# EAGLE design mütes expander (EAGLE 9.3.1)
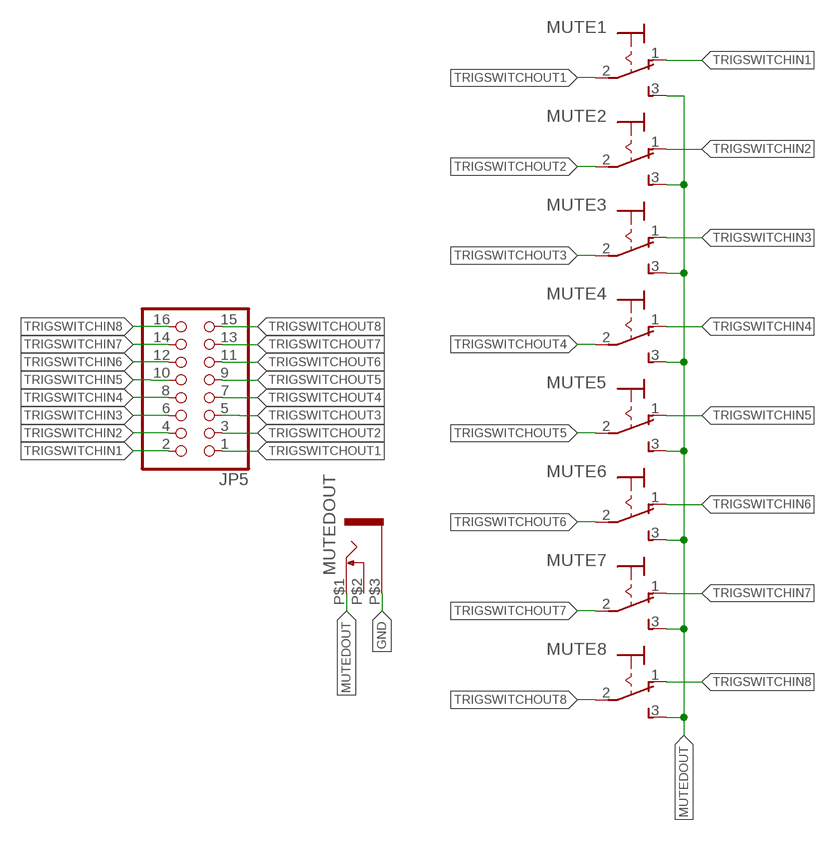
[diagram p0: schematic, sheet 1]

## Parts
JP5  PINHD-2X8  [2X08]
MUTE1  320-916320-916BIG  [320-916MY]
MUTE2  320-916320-916BIG  [320-916MY]
MUTE3  320-916320-916BIG  [320-916MY]
MUTE4  320-916320-916BIG  [320-916MY]
MUTE5  320-916320-916BIG  [320-916MY]
MUTE6  320-916320-916BIG  [320-916MY]
MUTE7  320-916320-916BIG  [320-916MY]
MUTE8  320-916320-916BIG  [320-916MY]
MUTEDOUT  WQP-PJ301M-12_JACK  [WQP-PJ301M-12_JACK]

## Nets
GND: MUTEDOUT.P$3
MUTEDOUT: MUTE1.3(S) MUTE2.3(S) MUTE3.3(S) MUTE4.3(S) MUTE5.3(S) MUTE6.3(S) MUTE7.3(S) MUTE8.3(S) MUTEDOUT.P$1
TRIGSWITCHIN1: JP5.2 MUTE1.1(O)
TRIGSWITCHIN2: JP5.4 MUTE2.1(O)
TRIGSWITCHIN3: JP5.6 MUTE3.1(O)
TRIGSWITCHIN4: JP5.8 MUTE4.1(O)
TRIGSWITCHIN5: JP5.10 MUTE5.1(O)
TRIGSWITCHIN6: JP5.12 MUTE6.1(O)
TRIGSWITCHIN7: JP5.14 MUTE7.1(O)
TRIGSWITCHIN8: JP5.16 MUTE8.1(O)
TRIGSWITCHOUT1: JP5.1 MUTE1.2(P)
TRIGSWITCHOUT2: JP5.3 MUTE2.2(P)
TRIGSWITCHOUT3: JP5.5 MUTE3.2(P)
TRIGSWITCHOUT4: JP5.7 MUTE4.2(P)
TRIGSWITCHOUT5: JP5.9 MUTE5.2(P)
TRIGSWITCHOUT6: JP5.11 MUTE6.2(P)
TRIGSWITCHOUT7: JP5.13 MUTE7.2(P)
TRIGSWITCHOUT8: JP5.15 MUTE8.2(P)
Unconnected: MUTEDOUT.P$2

## Library data of the parts
JP5 = pinhead:PINHD-2X8: PIN HEADER
MUTE1-MUTE8 = switch:320-916: TOGGLE SWITCH distributor RS Components
MUTEDOUT = thonkiconn:WQP-PJ301M-12_JACK

## Board
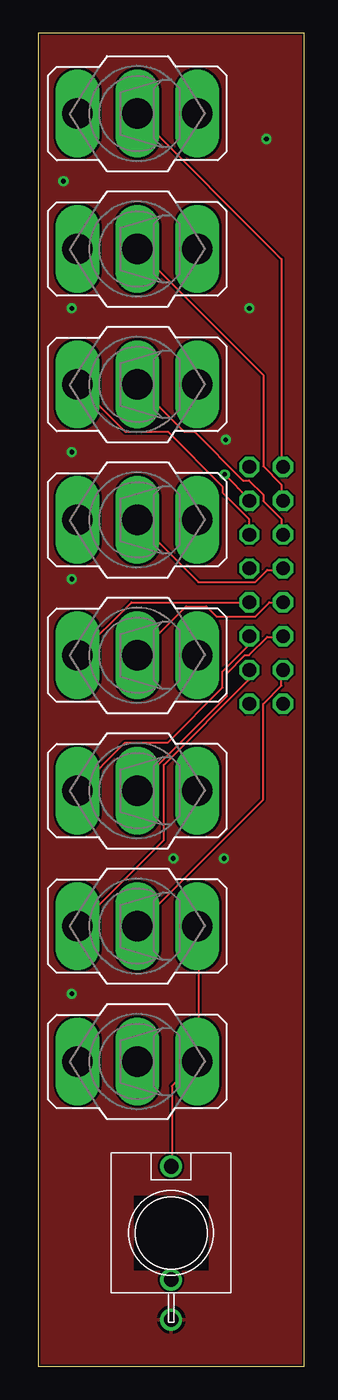
[diagram p1: board, top side]
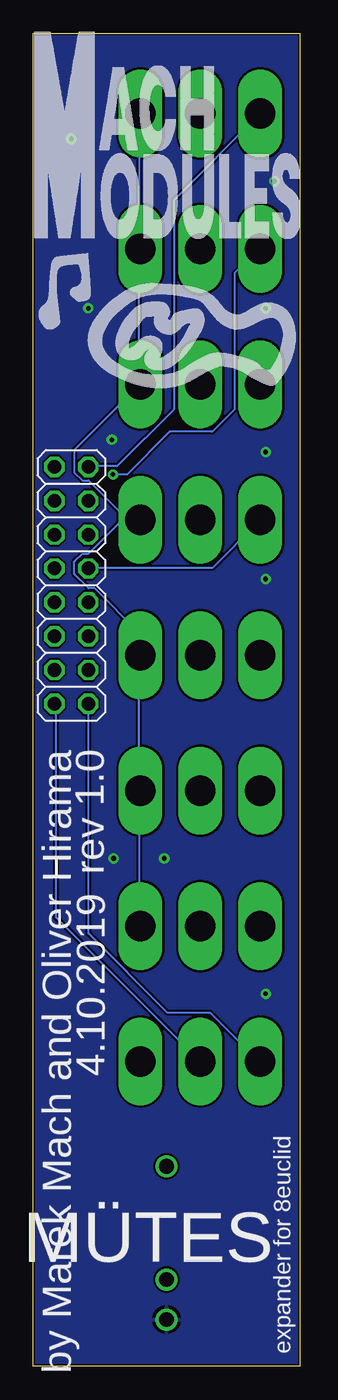
[diagram p2: board, bottom side, seen from below]

Size 20 x 100 mm. Coordinates in mm from the lower left corner, seen from the top.
Outline: 0,0 20,0 20,100 0,100 0,0
Copper layers (1*16): Top 0.035mm / dielectric 0.15mm / Bottom 0.035mm
Design rules "default *": minimum track width 6mil, minimum drill 0.35mm, track to track 6mil, track to pad 6mil, pad to pad 6mil, via to via 6mil, smd to smd 6mil, copper to edge 6mil, drill to drill 6mil, minimum pad ring 10mil, minimum via ring 8mil, stop-mask expansion 4mil, vias tented up to drill 50mil, thermal gap 10mil

### Footprints (pad centres in the part's own frame; a part is rotated, then mirrored left to right if it is on the bottom)
2X08 = drill 1.016 octagon: 1 -8.89,-1.27; 2 -8.89,1.27; 3 -6.35,-1.27; 4 -6.35,1.27; 5 -3.81,-1.27; 6 -3.81,1.27; 7 -1.27,-1.27; 8 -1.27,1.27; 9 1.27,-1.27; 10 1.27,1.27; 11 3.81,-1.27; 12 3.81,1.27; 13 6.35,-1.27; 14 6.35,1.27; 15 8.89,-1.27; 16 8.89,1.27
320-916MY = drill 2.3 long: 1 0,4.5; 2 0,0; 3 0,-4.5
WQP-PJ301M-12_JACK = drill 1.1: P$1 0,5; P$2 0,-3.5; P$3 0,-6.5

### Placement (x,y rotation side)
JP5  17.14,58.58 270 bottom
MUTE1  7.46,93.98 90 top
MUTE2  7.46,83.82 90 top
MUTE3  7.46,73.66 90 top
MUTE4  7.46,63.5 90 top
MUTE5  7.46,53.34 90 top
MUTE6  7.46,43.18 90 top
MUTE7  7.46,33.02 90 top
MUTE8  7.46,22.86 90 top
MUTEDOUT  10,10 0 top

### Tracks (layer width: path | path; a pad name or v marks a point on that pad's centre or on a via)
GND  (via drill 0.35)
  other vias: 2.54,27.94 2.54,59.05 2.54,68.58 2.54,79.38 15.88,79.38 1.91,88.9 17.14,92.08 10.16,38.1 13.97,38.1 14.1,69.51
  pour Top: 0,0 19.68,0 20.32,0 20.32,3.81 20.32,100.33 -0.64,100.33 -0.64,0
  pour Bottom: -0.64,0 20.32,0 20.32,3.81 20.32,100.33 -0.64,100.33
MUTEDOUT
  Top 0.152: MUTEDOUT.P$1 10.06,15.09 10.06,21.03 11.89,22.86 MUTE8.3 12.04,22.86 12.04,32.92 MUTE7.3
  Bottom 0.152: 12.04,83.82 12.04,93.88 MUTE1.3 | 13.11,63.7 15.85,66.45 16.31,66.45 16.92,67.06 16.92,68.73 12.04,73.61 MUTE3.3 12.04,73.76 12.04,83.82 | 13.11,63.7 12.95,63.55 12.04,63.55 MUTE4.3 13.11,63.7 | 12.04,83.82 MUTE2.3 | MUTE7.3 12.04,33.07 12.04,43.13 MUTE6.3 12.04,43.28 12.04,53.34 | 13.11,63.7 15.85,60.96 16.31,60.96 16.92,60.35 16.92,59.44 15.85,58.37 15.39,58.37 12.04,55.02 12.04,53.34 | 12.04,53.34 MUTE5.3
TRIGSWITCHIN1
  Bottom 0.152: JP5.2 15.85,67.51 13.72,67.51 9.45,71.78 9.45,87.48 3.05,93.88 MUTE1.1
TRIGSWITCHIN2  (via drill 0.35)
  Top 0.152: v14.02,66.9 15.85,65.08 JP5.4
  Bottom 0.152: v14.02,66.9 12.95,66.9 9.75,70.1 6.55,70.1 4.88,71.78 4.88,81.99 3.05,83.82 MUTE2.1
TRIGSWITCHIN3
  Top 0.152: JP5.6 15.85,62.48 15.85,63.55 13.87,65.53 13.87,65.99 9.75,70.1 6.55,70.1 3.05,73.61 MUTE3.1
TRIGSWITCHIN4
  Bottom 0.152: JP5.8 15.85,59.89 6.55,59.89 3.05,63.4 MUTE4.1
TRIGSWITCHIN5
  Top 0.152: JP5.10 15.85,57.3 7.01,57.3 3.05,53.34 MUTE5.1
TRIGSWITCHIN6
  Top 0.152: JP5.12 15.85,54.71 15.85,54.1 13.87,52.12 13.87,50.9 9.75,46.79 6.55,46.79 3.05,43.28 MUTE6.1
TRIGSWITCHIN7
  Top 0.152: JP5.14 15.85,52.12 15.85,51.51 9.45,45.11 9.45,39.47 3.05,33.07 MUTE7.1
TRIGSWITCHIN8
  Bottom 0.152: JP5.16 15.85,49.68 15.85,32.46 9.91,26.52 6.71,26.52 3.05,22.86 MUTE8.1
TRIGSWITCHOUT1
  Top 0.152: JP5.1 18.29,67.51 18.29,83.06 7.47,93.88 MUTE1.2
TRIGSWITCHOUT2
  Top 0.152: JP5.3 18.29,65.08 18.29,66.14 16.92,67.51 16.92,74.37 MUTE2.2
TRIGSWITCHOUT3
  Top 0.152: JP5.5 18.29,62.48 18.29,63.55 16.92,64.92 16.92,65.38 15.85,66.45 15.39,66.45 11.73,70.1 10.97,70.1 7.47,73.61 MUTE3.2
TRIGSWITCHOUT4
  Top 0.152: JP5.7 18.29,59.74 17.22,59.74 16.31,58.83 12.04,58.83 7.47,63.4 MUTE4.2
TRIGSWITCHOUT5
  Top 0.152: JP5.9 18.29,57.3 17.37,57.3 16.31,56.24 13.41,56.24 12.65,57 11.12,57 MUTE5.2
TRIGSWITCHOUT6
  Top 0.152: JP5.11 18.29,54.71 17.22,54.71 15.85,53.34 15.54,53.34 14.17,51.97 14.17,50.29 7.47,43.59 7.47,43.28 MUTE6.2
TRIGSWITCHOUT7
  Top 0.152: JP5.13 18.29,52.12 18.29,51.05 16.92,49.68 16.92,42.52 7.47,33.07 MUTE7.2
TRIGSWITCHOUT8
  Bottom 0.152: JP5.15 18.29,49.68 18.29,33.68 MUTE8.2

### Text on the board
bNames: rev 1.0 | by Marek Mach and Oliver Hirama | 4.10.2019 | MÜTES | expander for 8euclid | F:/eurorack-master/Hirama black logo2 mirrored 4hp 2000dpi.bmp